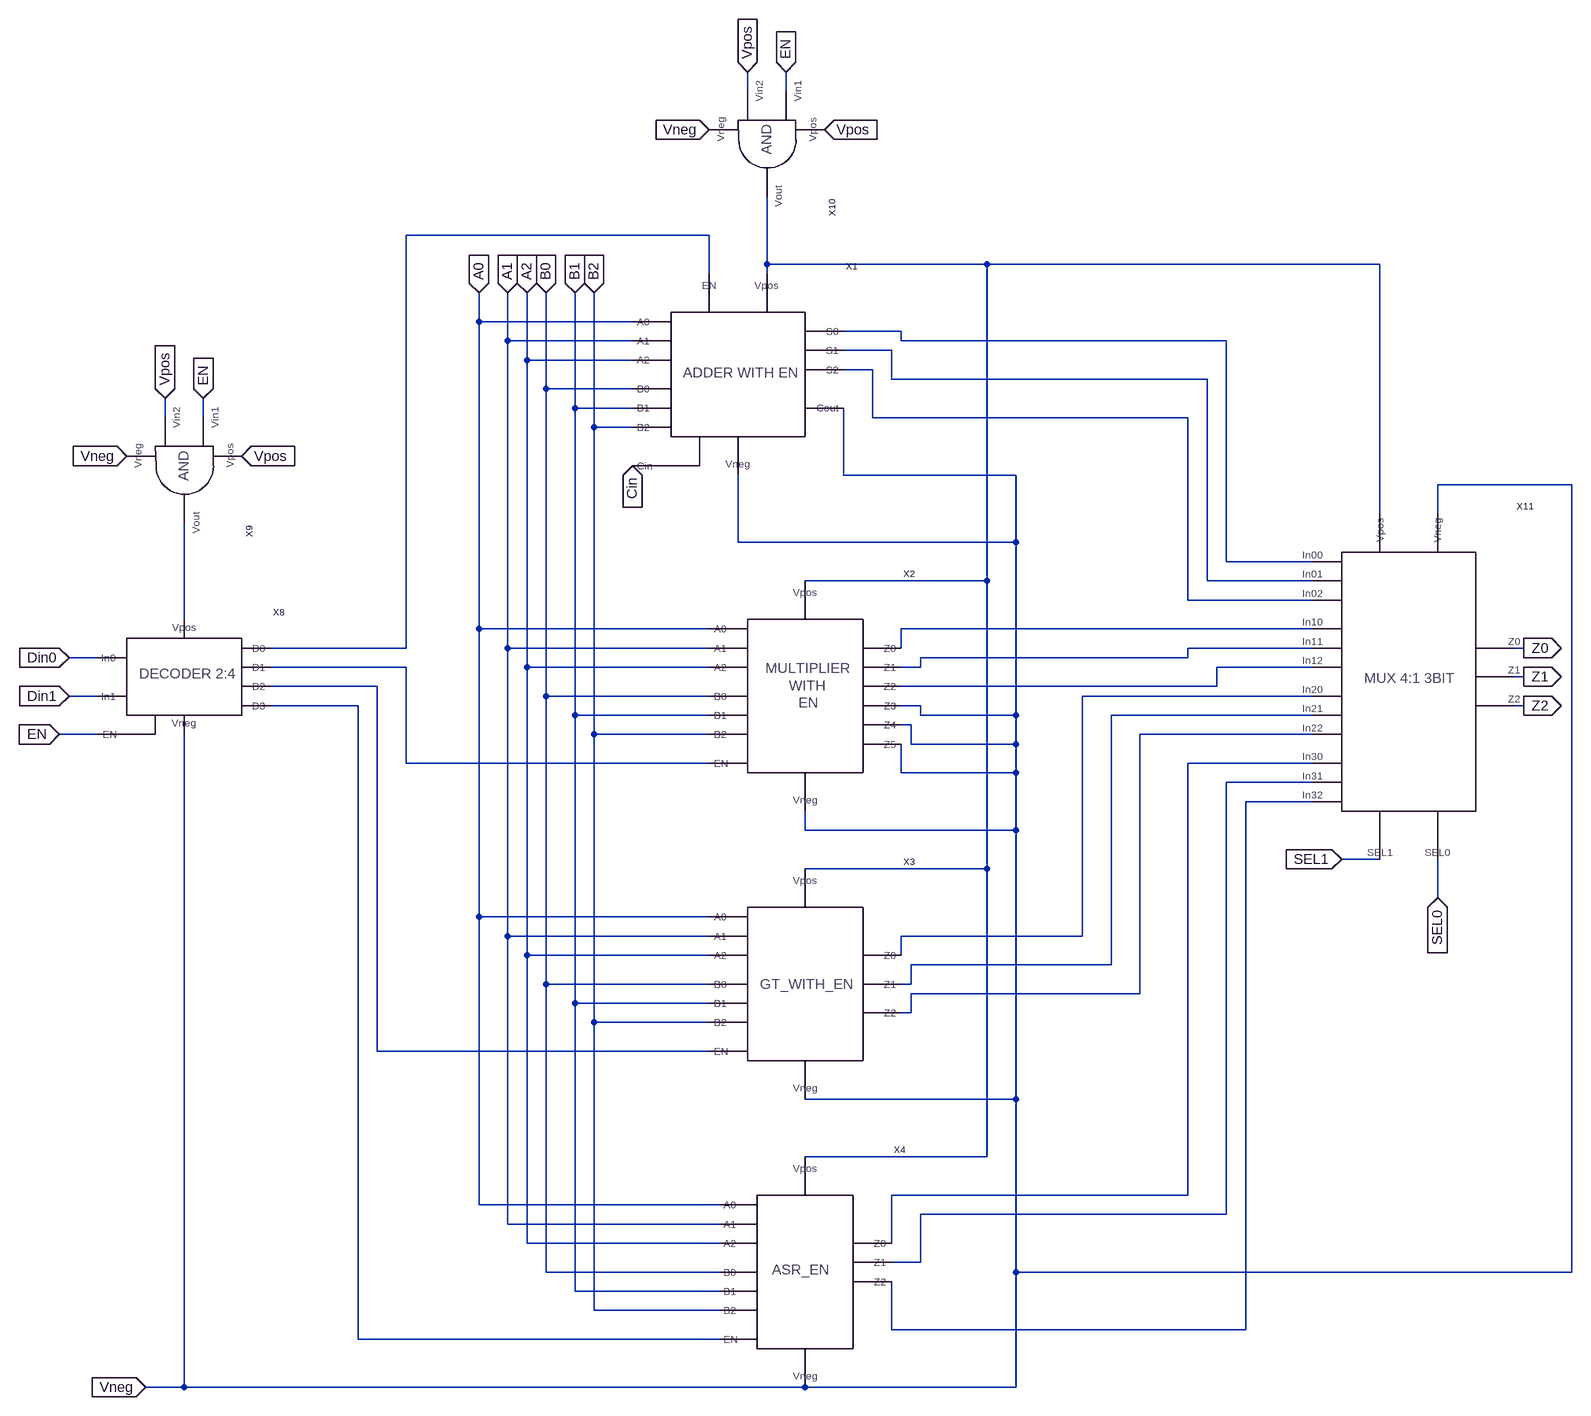
[diagram p0: schematic PART_2_B_SYM.asc]
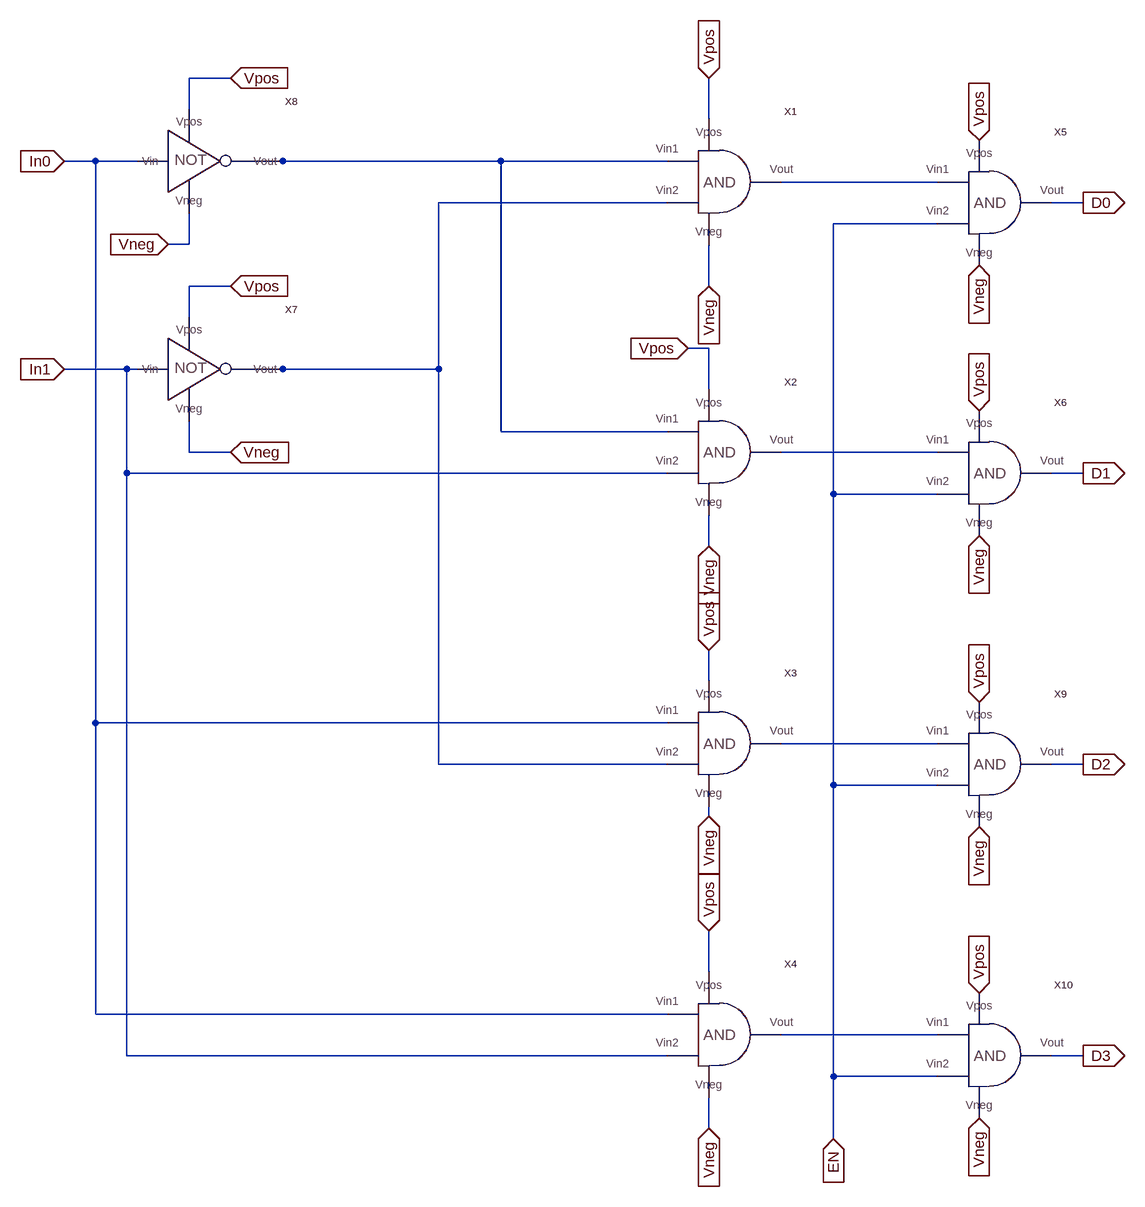
[diagram p1: sub-circuit decoder2_4.asc]
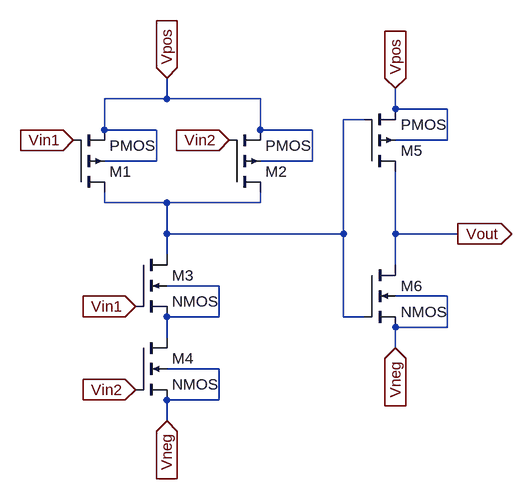
[diagram p2: sub-circuit and_sym.asc]
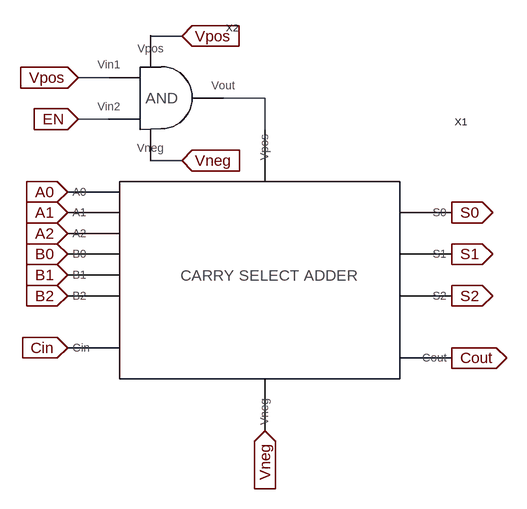
[diagram p3: sub-circuit adder_en_sym.asc]
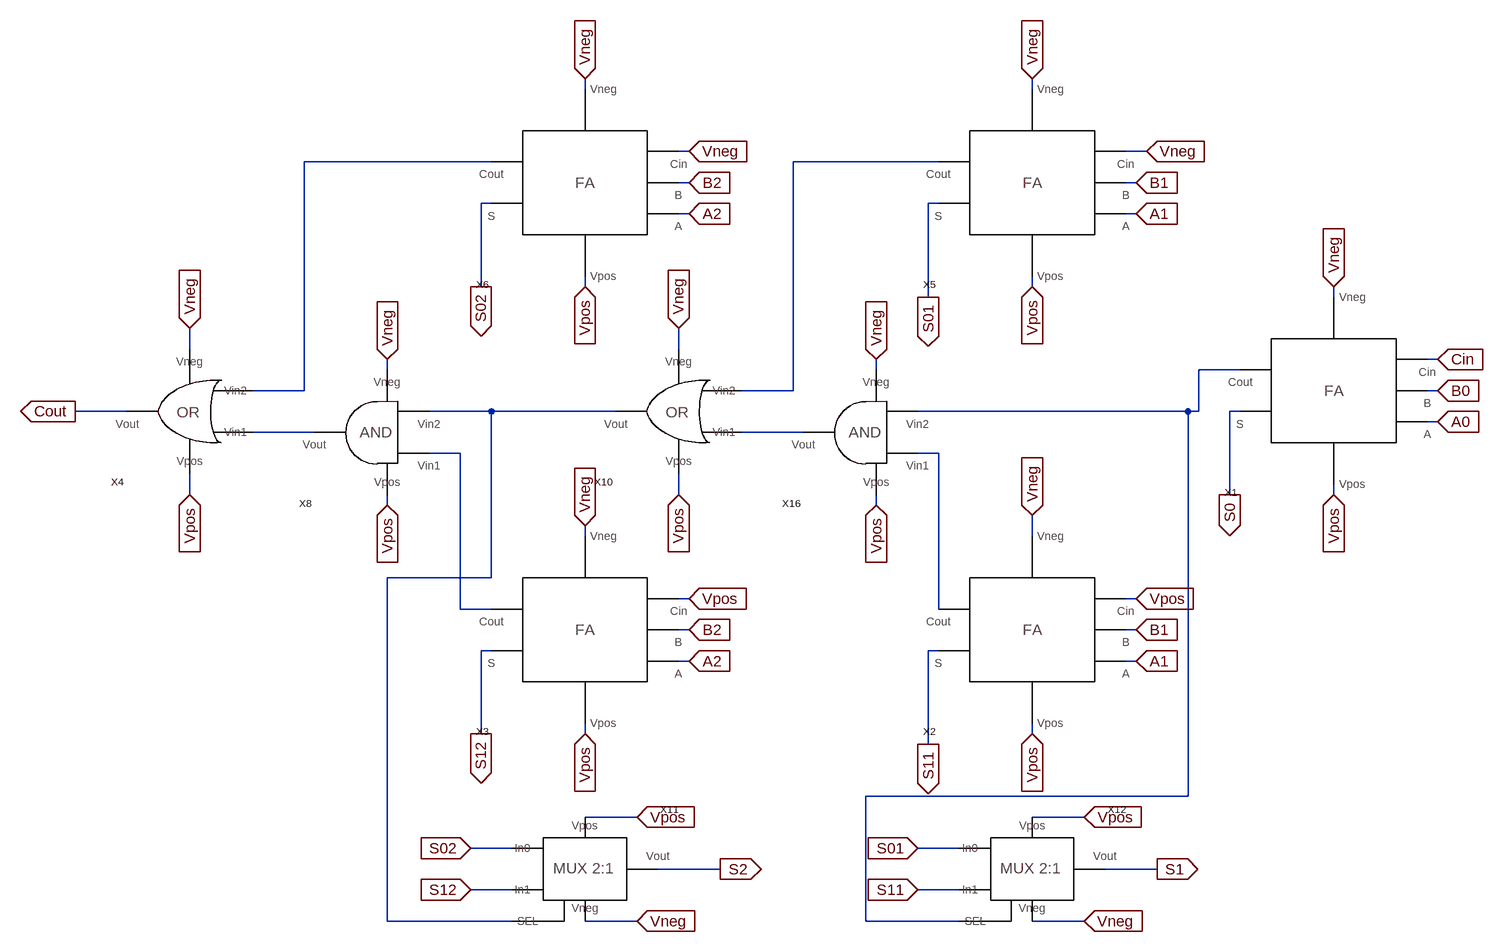
[diagram p4: sub-circuit carry_select_adder_sym.asc]
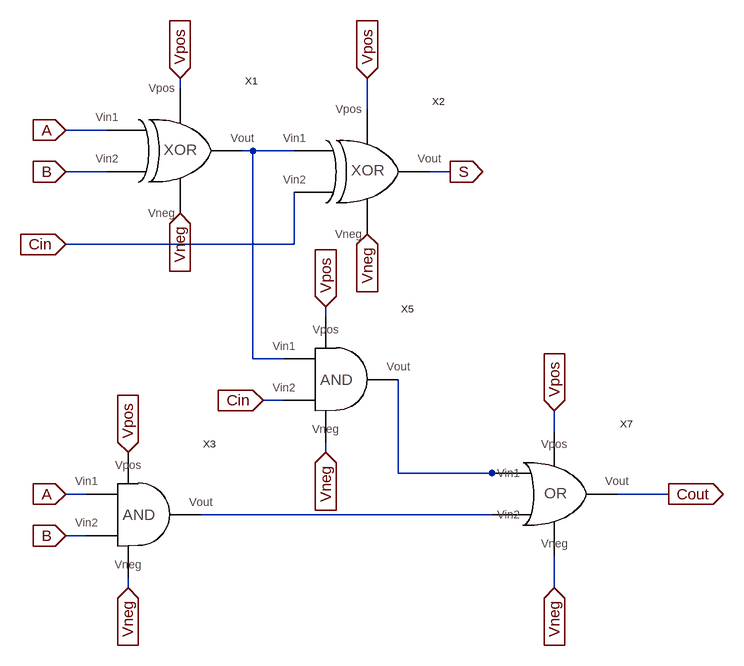
[diagram p5: sub-circuit full_adder_sym.asc]
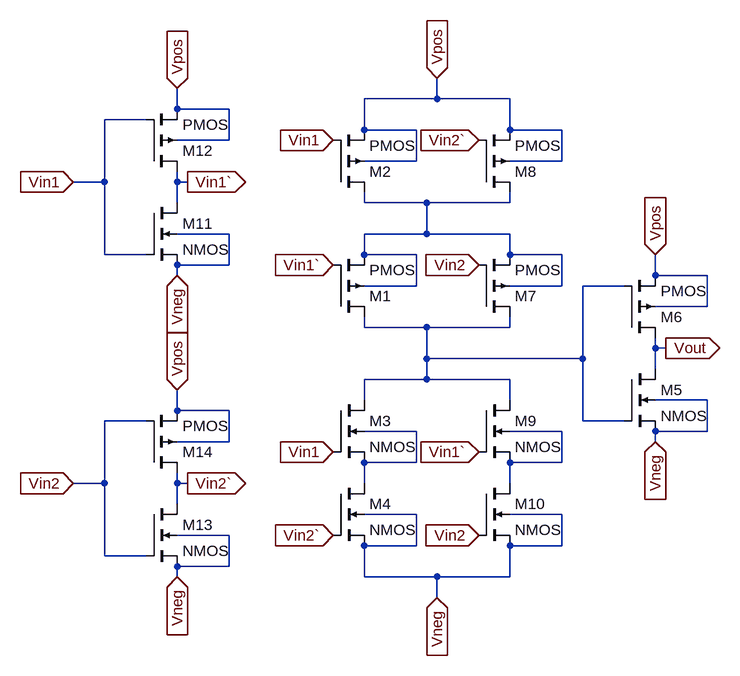
[diagram p6: sub-circuit xor_sym.asc]
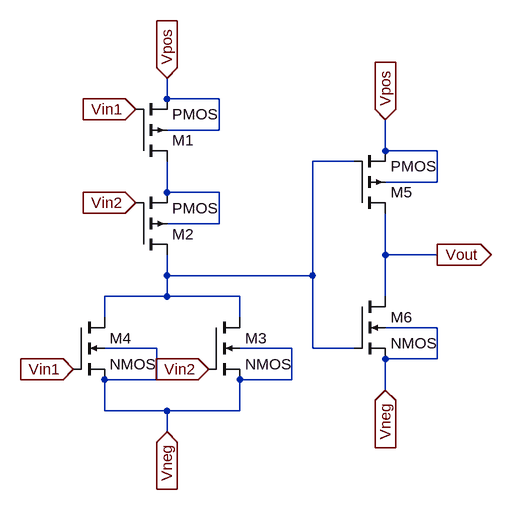
[diagram p7: sub-circuit or_sym.asc]
PART_2_B_SYM.asc, the LTspice schematic file:
Version 4
SHEET 1 2680 1448
WIRE 160 -784 160 -816
WIRE 224 -784 224 -816
WIRE 96 -544 -448 -544
WIRE 192 -496 192 -608
WIRE 624 -496 192 -496
WIRE 2336 -496 624 -496
WIRE 96 -480 96 -544
WIRE 192 -480 192 -496
WIRE -288 -400 -288 -448
WIRE -32 -400 -288 -400
WIRE 416 -384 320 -384
WIRE -240 -368 -240 -448
WIRE -32 -368 -240 -368
WIRE 416 -368 416 -384
WIRE 2080 -368 416 -368
WIRE 400 -352 320 -352
WIRE -208 -336 -208 -448
WIRE -32 -336 -208 -336
WIRE 368 -320 320 -320
WIRE 400 -304 400 -352
WIRE 2048 -304 400 -304
WIRE -176 -288 -176 -448
WIRE -32 -288 -176 -288
WIRE -128 -256 -128 -448
WIRE -32 -256 -128 -256
WIRE -928 -240 -928 -272
WIRE -864 -240 -864 -272
WIRE 368 -240 368 -320
WIRE 2016 -240 368 -240
WIRE -96 -224 -96 -448
WIRE -32 -224 -96 -224
WIRE 320 -144 320 -256
WIRE 672 -144 320 -144
WIRE 2656 -128 2432 -128
WIRE 2336 -80 2336 -496
WIRE 2432 -80 2432 -128
WIRE 144 -32 144 -144
WIRE 672 -32 672 -144
WIRE 672 -32 144 -32
WIRE 2080 0 2080 -368
WIRE 2224 0 2080 0
WIRE 624 32 624 -496
WIRE 624 32 256 32
WIRE 2048 32 2048 -304
WIRE 2224 32 2048 32
WIRE 2016 64 2016 -240
WIRE 2224 64 2016 64
WIRE -896 96 -896 -64
WIRE -288 112 -288 -400
WIRE 96 112 -288 112
WIRE 2224 112 416 112
WIRE -448 144 -448 -544
WIRE -448 144 -752 144
WIRE -240 144 -240 -368
WIRE 96 144 -240 144
WIRE 416 144 416 112
WIRE 2224 144 2016 144
WIRE 2576 144 2560 144
WIRE -1040 160 -1088 160
WIRE 2016 160 2016 144
WIRE 2016 160 448 160
WIRE -448 176 -752 176
WIRE -208 176 -208 -336
WIRE 96 176 -208 176
WIRE 448 176 448 160
WIRE 448 176 416 176
WIRE 2224 176 2064 176
WIRE 2576 192 2560 192
WIRE -496 208 -752 208
WIRE 2064 208 2064 176
WIRE 2064 208 416 208
WIRE -1040 224 -1088 224
WIRE -176 224 -176 -288
WIRE 96 224 -176 224
WIRE 2224 224 1840 224
WIRE -528 240 -752 240
WIRE 448 240 416 240
WIRE 2576 240 2560 240
WIRE -128 256 -128 -256
WIRE 96 256 -128 256
WIRE 448 256 448 240
WIRE 672 256 672 -32
WIRE 672 256 448 256
WIRE 2224 256 1888 256
WIRE 432 272 416 272
WIRE -1040 288 -1104 288
WIRE -96 288 -96 -224
WIRE 96 288 -96 288
WIRE 2224 288 1936 288
WIRE 432 304 432 272
WIRE 672 304 672 256
WIRE 672 304 432 304
WIRE -448 336 -448 176
WIRE 96 336 -448 336
WIRE 2224 336 2016 336
WIRE 416 352 416 304
WIRE 672 352 672 304
WIRE 672 352 416 352
WIRE 2224 368 2080 368
WIRE 2224 400 2112 400
WIRE 256 448 256 416
WIRE 672 448 672 352
WIRE 672 448 256 448
WIRE 2336 496 2272 496
WIRE 624 512 624 32
WIRE 624 512 256 512
WIRE 2432 560 2432 496
WIRE -288 592 -288 112
WIRE 96 592 -288 592
WIRE -240 624 -240 144
WIRE 96 624 -240 624
WIRE 1840 624 1840 224
WIRE 1840 624 416 624
WIRE -208 656 -208 176
WIRE 96 656 -208 656
WIRE 416 656 416 624
WIRE 1888 672 1888 256
WIRE 1888 672 432 672
WIRE -176 704 -176 224
WIRE 96 704 -176 704
WIRE 432 704 432 672
WIRE 432 704 416 704
WIRE 1936 720 1936 288
WIRE 1936 720 432 720
WIRE -128 736 -128 256
WIRE 96 736 -128 736
WIRE 432 752 432 720
WIRE 432 752 416 752
WIRE -96 768 -96 288
WIRE 96 768 -96 768
WIRE -496 816 -496 208
WIRE 96 816 -496 816
WIRE 672 896 672 448
WIRE 672 896 256 896
WIRE 624 992 624 512
WIRE 624 992 256 992
WIRE 2016 1056 2016 336
WIRE 2016 1056 400 1056
WIRE -288 1072 -288 592
WIRE 112 1072 -288 1072
WIRE 2080 1088 2080 368
WIRE 2080 1088 448 1088
WIRE -240 1104 -240 624
WIRE 112 1104 -240 1104
WIRE -208 1136 -208 656
WIRE 112 1136 -208 1136
WIRE 400 1136 400 1056
WIRE 448 1168 448 1088
WIRE 448 1168 400 1168
WIRE -176 1184 -176 704
WIRE 112 1184 -176 1184
WIRE 672 1184 672 896
WIRE 2656 1184 2656 -128
WIRE 2656 1184 672 1184
WIRE -128 1216 -128 736
WIRE 112 1216 -128 1216
WIRE -96 1248 -96 768
WIRE 112 1248 -96 1248
WIRE 400 1280 400 1200
WIRE 2112 1280 2112 400
WIRE 2112 1280 400 1280
WIRE -528 1296 -528 240
WIRE 112 1296 -528 1296
WIRE -896 1376 -896 288
WIRE -896 1376 -960 1376
WIRE 256 1376 -896 1376
WIRE 672 1376 672 1184
WIRE 672 1376 256 1376
FLAG -288 -448 A0
IOPIN -288 -448 In
FLAG -240 -448 A1
IOPIN -240 -448 In
FLAG -208 -448 A2
IOPIN -208 -448 In
FLAG -176 -448 B0
IOPIN -176 -448 In
FLAG -128 -448 B1
IOPIN -128 -448 In
FLAG -96 -448 B2
IOPIN -96 -448 In
FLAG 2272 496 SEL1
IOPIN 2272 496 In
FLAG 2432 560 SEL0
IOPIN 2432 560 In
FLAG -1088 160 Din0
IOPIN -1088 160 In
FLAG -1088 224 Din1
IOPIN -1088 224 In
FLAG -1104 288 EN
IOPIN -1104 288 In
FLAG -960 1376 Vneg
IOPIN -960 1376 In
FLAG -32 -160 Cin
IOPIN -32 -160 In
FLAG 96 -720 Vneg
IOPIN 96 -720 In
FLAG 160 -816 Vpos
IOPIN 160 -816 In
FLAG 224 -816 EN
IOPIN 224 -816 In
FLAG 288 -720 Vpos
IOPIN 288 -720 In
FLAG -928 -272 Vpos
IOPIN -928 -272 In
FLAG -864 -272 EN
IOPIN -864 -272 In
FLAG -800 -176 Vpos
IOPIN -800 -176 In
FLAG -992 -176 Vneg
IOPIN -992 -176 In
FLAG 2576 144 Z0
IOPIN 2576 144 Out
FLAG 2576 192 Z1
IOPIN 2576 192 Out
FLAG 2576 240 Z2
IOPIN 2576 240 Out
SYMBOL DECODER2_4 -896 192 R0
SYMATTR InstName X8
SYMBOL ADDER_EN_SYM 144 -320 R0
SYMATTR InstName X1
SYMBOL MULTIPLIER_EN_SYM 256 176 R0
SYMATTR InstName X2
SYMBOL GT_EN_SYM 256 672 R0
SYMATTR InstName X3
SYMBOL ASR_EN_SYM 256 1184 R0
SYMATTR InstName X4
SYMBOL AND_SYM -896 -160 R90
SYMATTR InstName X9
SYMBOL AND_SYM 192 -704 R90
SYMATTR InstName X10
SYMBOL MUX3BIT_SYM 2384 112 R0
SYMATTR InstName X11

The netlist it stands for:
* PART_2_B_SYM.asc
XX8 Din0 Din1 N001 N009 N011 N013 Vneg N006 EN decoder2_4
XX1 A0 A1 A2 B0 B1 B2 N002 N001 Vneg N003 N004 N005 Vneg Cin adder_en_sym
XX2 A0 A1 A2 B0 B1 B2 N009 N002 N007 Vneg N008 N010 Vneg Vneg Vneg multiplier_en_sym
XX3 A0 A1 A2 B0 B1 B2 N011 N002 N012 N014 N015 Vneg gt_en_sym
XX4 N002 A0 A1 A2 B0 B1 B2 N013 Vneg N016 N017 N018 asr_en_sym
XX9 EN Vpos Vpos Vneg N006 and_sym
XX10 EN Vpos Vpos Vneg N002 and_sym
XX11 N002 Vneg N003 N004 N005 N007 N008 N010 N012 N014 N015 N016 N017 N018 Z0 Z1 Z2 SEL0 SEL1 mux3bit_sym

* block symbol definitions
.subckt decoder2_4 In0 In1 D0 D1 D2 D3 Vneg Vpos EN
XX1 N001 N003 Vpos Vneg N002 and_sym
XX2 N001 In1 Vpos Vneg N004 and_sym
XX3 In0 N003 Vpos Vneg N005 and_sym
XX4 In0 In1 Vpos Vneg N006 and_sym
XX7 In1 Vpos N003 Vneg NOT_SYM  ; pins Vin Vpos Vout Vneg
XX8 In0 Vpos N001 Vneg NOT_SYM  ; pins Vin Vpos Vout Vneg
XX5 N002 EN Vpos Vneg D0 and_sym
XX6 N004 EN Vpos Vneg D1 and_sym
XX9 N005 EN Vpos Vneg D2 and_sym
XX10 N006 EN Vpos Vneg D3 and_sym
.ends decoder2_4

.subckt and_sym Vin1 Vin2 Vpos Vneg Vout
M1 N001 Vin1 Vpos Vpos PMOS
M2 N001 Vin2 Vpos Vpos PMOS
M3 N001 Vin1 N002 N002 NMOS
M4 N002 Vin2 Vneg Vneg NMOS
M5 Vout N001 Vpos Vpos PMOS
M6 Vout N001 Vneg Vneg NMOS
.ends and_sym

.subckt adder_en_sym A0 A1 A2 B0 B1 B2 Vpos EN Vneg S0 S1 S2 Cout Cin
XX1 A0 A1 A2 B0 B1 B2 Cout N001 Vneg S0 S1 S2 Cin carry_select_adder_sym
XX2 Vpos EN Vpos Vneg N001 and_sym
.ends adder_en_sym

.subckt carry_select_adder_sym A0 A1 A2 B0 B1 B2 Cout Vpos Vneg S0 S1 S2 Cin
XX1 A0 B0 Cin S0 N003 Vpos Vneg full_adder_sym
XX2 A1 B1 Vpos S11 N008 Vpos Vneg full_adder_sym
XX3 A2 B2 Vpos S12 N007 Vpos Vneg full_adder_sym
XX5 A1 B1 Vneg S01 N002 Vpos Vneg full_adder_sym
XX6 A2 B2 Vneg S02 N001 Vpos Vneg full_adder_sym
XX10 Vpos N006 N002 N004 Vneg or_sym
XX11 S02 S12 N004 Vpos Vneg S2 mux2_1
XX12 S01 S11 N003 Vpos Vneg S1 mux2_1
XX16 N008 N003 Vpos Vneg N006 and_sym
XX4 Vpos N005 N001 Cout Vneg or_sym
XX8 N007 N004 Vpos Vneg N005 and_sym
.ends carry_select_adder_sym

.subckt full_adder_sym A B Cin S Cout Vpos Vneg
XX1 A B Vpos N001 Vneg xor_sym
XX2 N001 Cin Vpos S Vneg xor_sym
XX3 A B Vpos Vneg N003 and_sym
XX5 N001 Cin Vpos Vneg N002 and_sym
XX7 Vpos N002 N003 Cout Vneg or_sym
.ends full_adder_sym

.subckt xor_sym Vin1 Vin2 Vpos Vout Vneg
M1 N002 Vin1` N001 N001 PMOS
M2 N001 Vin1 Vpos Vpos PMOS
M3 N002 Vin1 N003 N003 NMOS
M4 N003 Vin2` Vneg Vneg NMOS
M5 Vout N002 Vneg Vneg NMOS
M6 Vout N002 Vpos Vpos PMOS
M7 N002 Vin2 N001 N001 PMOS
M8 N001 Vin2` Vpos Vpos PMOS
M9 N002 Vin1` N004 N004 NMOS
M10 N004 Vin2 Vneg Vneg NMOS
M11 Vin1` Vin1 Vneg Vneg NMOS
M12 Vin1` Vin1 Vpos Vpos PMOS
M13 Vin2` Vin2 Vneg Vneg NMOS
M14 Vin2` Vin2 Vpos Vpos PMOS
.ends xor_sym

.subckt or_sym Vpos Vin1 Vin2 Vout Vneg
M1 N002 Vin1 Vpos Vpos PMOS
M2 N001 Vin2 N002 N002 PMOS
M3 N001 Vin2 Vneg Vneg NMOS
M4 N001 Vin1 Vneg Vneg NMOS
M5 Vout N001 Vpos Vpos PMOS
M6 Vout N001 Vneg Vneg NMOS
.ends or_sym

.subckt mux2_1 In0 In1 SEL Vpos Vneg Vout
XX1 In1 SEL Vpos Vneg N003 and_sym
XX2 In0 N002 Vpos Vneg N001 and_sym
XX4 Vpos N001 N003 Vout Vneg or_sym
XX5 SEL Vpos N002 Vneg NOT_SYM  ; pins Vin Vpos Vout Vneg
.ends mux2_1

.subckt multiplier_en_sym A0 A1 A2 B0 B1 B2 EN Vpos Z0 Vneg Z1 Z2 Z3 Z4 Z5
XX1 A0 A1 A2 B0 B1 B2 N001 Vneg Z0 Z1 Z2 Z3 Z4 Z5 multiplier_sym
XX2 Vpos EN Vpos Vneg N001 and_sym
.ends multiplier_en_sym

.subckt multiplier_sym A0 A1 A2 B0 B1 B2 Vpos Vneg Z0 Z1 Z2 Z3 Z4 Z5
XX2 B0 A0 Vpos Vneg Z0 and_sym
XX4 B0 A1 Vpos Vneg N001 and_sym
XX5 A2 B0 Vpos Vneg N003 and_sym
XX1 N001 N003 Vneg N006 N008 N010 N005 Vpos Vneg Z1 N002 N004 Vneg carry_select_adder_sym
XX3 N002 N004 N005 N007 N009 N011 Z5 Vpos Vneg Z2 Z3 Z4 Vneg carry_select_adder_sym
XX9 B1 A0 Vpos Vneg N006 and_sym
XX10 B1 A1 Vpos Vneg N008 and_sym
XX11 A2 B1 Vpos Vneg N010 and_sym
XX12 B2 A0 Vpos Vneg N007 and_sym
XX13 B2 A1 Vpos Vneg N009 and_sym
XX14 A2 B2 Vpos Vneg N011 and_sym
.ends multiplier_sym

.subckt gt_en_sym A0 A1 A2 B0 B1 B2 EN Vpos Z0 Z1 Z2 Vneg
XX1 A0 A1 A2 B0 B1 B2 Z0 Z1 Z2 N001 Vneg gt_sym
XX2 Vpos EN Vpos Vneg N001 and_sym
.ends gt_en_sym

.subckt gt_sym A0 A1 A2 B0 B1 B2 Z0 Z1 Z2 Vpos Vneg
XX22 Vpos A0 N009 Vpos Vneg Z0 mux2_1
XX23 Vpos A1 N009 Vpos Vneg Z1 mux2_1
XX24 Vpos A2 N009 Vpos Vneg Z2 mux2_1
XX25 Vpos N007 N012 N009 Vneg or_sym
XX1 A2 B2 Vpos N013 Vneg xnor_sym
XX2 A2 P001 Vpos Vneg N008 and_sym
XX3 B2 Vpos P001 Vneg NOT_SYM  ; pins Vin Vpos Vout Vneg
XX4 A1 P002 Vpos Vneg N006 and_sym
XX5 B1 Vpos P002 Vneg NOT_SYM  ; pins Vin Vpos Vout Vneg
XX8 A0 P003 Vpos Vneg N001 and_sym
XX9 B0 Vpos P003 Vneg NOT_SYM  ; pins Vin Vpos Vout Vneg
XX10 A1 B1 Vpos N014 Vneg xnor_sym
XX11 B0 A0 Vpos N015 Vneg xnor_sym
XX12 N013 N014 Vpos Vneg N003 and_sym
XX13 N001 N003 Vpos Vneg N002 and_sym
XX14 N003 N015 Vpos Vneg N011 and_sym
XX15 Vpos N002 N005 N004 Vneg or_sym
XX16 Vpos N004 N008 N007 Vneg or_sym
XX17 N006 N013 Vpos Vneg N005 and_sym
XX6 N007 N011 Vpos N010 Vneg xnor_sym
XX7 N010 N011 Vpos N012 Vneg xnor_sym
.ends gt_sym

.subckt xnor_sym Vin1 Vin2 Vpos Vout Vneg
M1 Vout Vin1` N001 N001 PMOS
M2 N001 Vin1 Vpos Vpos PMOS
M3 Vout Vin1 N002 N002 NMOS
M4 N002 Vin2` Vneg Vneg NMOS
M7 Vout Vin2 N001 N001 PMOS
M8 N001 Vin2` Vpos Vpos PMOS
M9 Vout Vin1` N003 N003 NMOS
M10 N003 Vin2 Vneg Vneg NMOS
M11 Vin1` Vin1 Vneg Vneg NMOS
M12 Vin1` Vin1 Vpos Vpos PMOS
M13 Vin2` Vin2 Vneg Vneg NMOS
M14 Vin2` Vin2 Vpos Vpos PMOS
.ends xnor_sym

.subckt asr_en_sym Vpos A0 A1 A2 B0 B1 B2 EN Vneg Z0 Z1 Z2
XX1 A0 A1 A2 B0 B1 B2 Z0 Z1 Z2 N001 Vneg asr_symbol
XX2 Vpos EN Vpos Vneg N001 and_sym
.ends asr_en_sym

.subckt asr_symbol A0 A1 A2 B0 B1 B2 Z0 Z1 Z2 Vpos Vneg
XX1 Vpos A0 A1 A2 A2 A2 A2 A2 A2 B1 B2 B0 Z0 Vneg mux_8_1_symbol
XX2 Vpos A1 A2 A2 A2 A2 A2 A2 A2 B1 B2 B0 Z1 Vneg mux_8_1_symbol
XX3 Vpos A2 A2 A2 A2 A2 A2 A2 A2 B1 B2 B0 Z2 Vneg mux_8_1_symbol
.ends asr_symbol

.subckt mux_8_1_symbol Vpos In0 In1 In2 In3 In4 In5 In6 In7 SEL1 SEL2 SEL0 Vout Vneg
XX1 N001 Vpos Vneg In0 In1 In2 In3 SEL1 SEL0 mux4_1_sym
XX2 N002 Vpos Vneg In4 In5 In6 In7 SEL1 SEL0 mux4_1_sym
XX3 N001 N002 SEL2 Vpos Vneg Vout mux2_1
.ends mux_8_1_symbol

.subckt mux4_1_sym Vout Vpos Vneg In0 In1 In2 In3 SEL1 SEL0
XX1 In0 In1 SEL0 Vpos Vneg N001 mux2_1
XX2 N001 N002 SEL1 Vpos Vneg Vout mux2_1
XX3 In2 In3 SEL0 Vpos Vneg N002 mux2_1
.ends mux4_1_sym

.subckt mux3bit_sym Vpos Vneg In00 In01 In02 In10 In11 In12 In20 In21 In22 In30 In31 In32 Z0 Z1 Z2 SEL0 SEL1
XX1 Z0 Vpos Vneg In00 In10 In20 In30 SEL1 SEL0 mux4_1_sym
XX2 Z1 Vpos Vneg In01 In11 In21 In31 SEL1 SEL0 mux4_1_sym
XX3 Z2 Vpos Vneg In02 In12 In22 In32 SEL1 SEL0 mux4_1_sym
.ends mux3bit_sym

.model NMOS NMOS
.model PMOS PMOS
.lib standard.mos
.backanno
.end